# Altium schematic sheet sch.SchDoc
size A; SheetNumber: 1; SheetTotal: 1
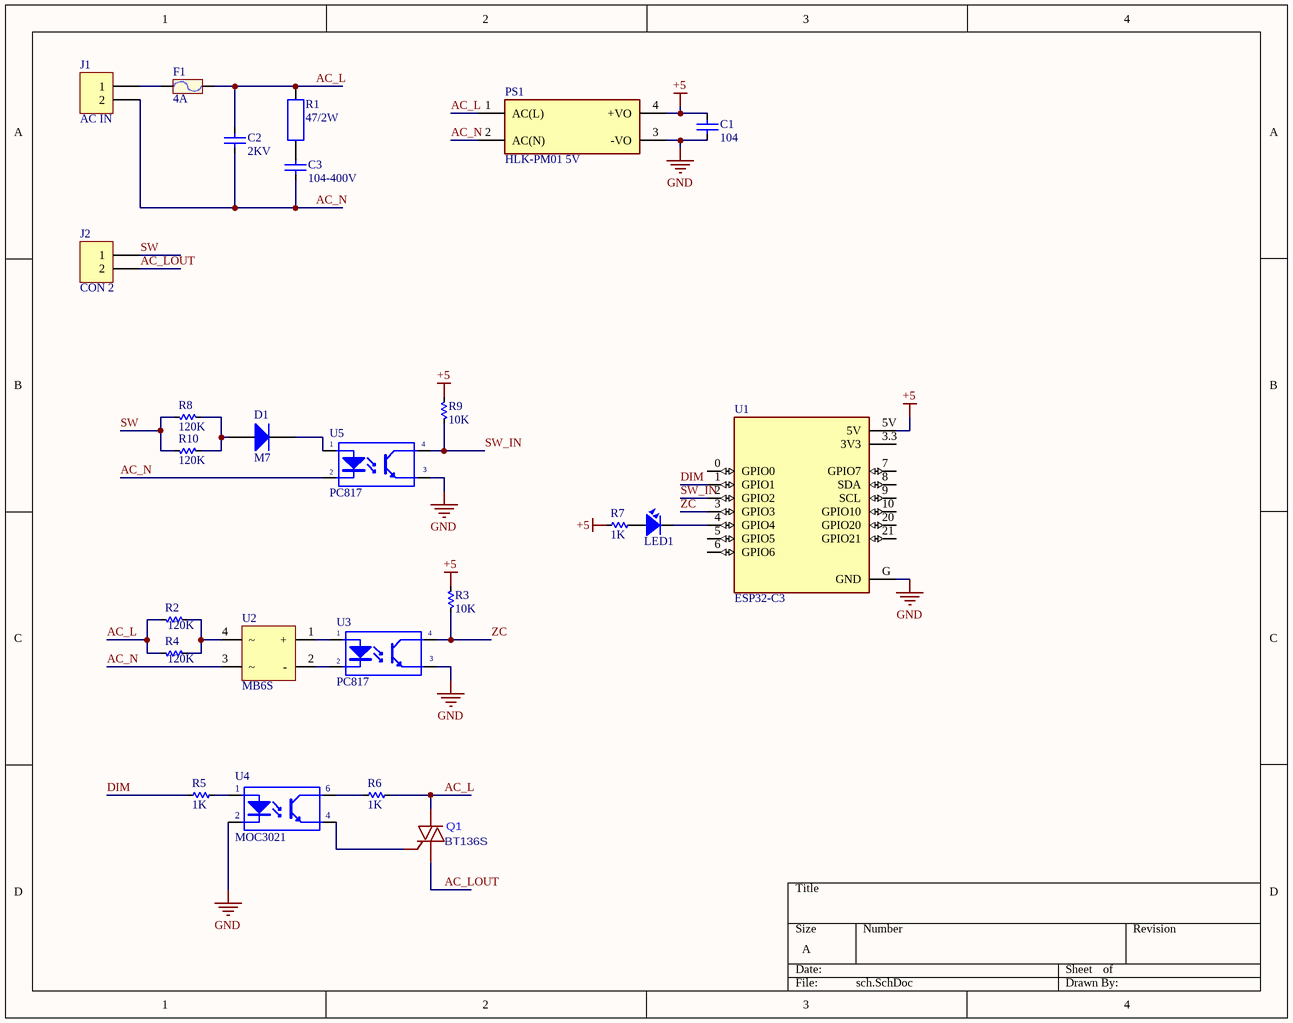
[diagram p0: sch.SchDoc]

## Parts
C1  104  [cap 0805]
C2  2KV  [Cap 7.5mm]
C3  104-400V  [Cap 10mm]
D1  M7  [DIODE SMA]
F1  4A  [Fuse rectangular]
J1  AC IN  [CON 2 2EDG5.08 B]
J2  CON 2  [CON 2 2EDG5.08 B]
LED1  LED  [LED-0805-Blue]  (value not drawn)
PS1  HLK-PM01 5V  [CONV_HLK-PM01-3W]
Q1  BT136S  [TO-252-3_L6.6-W6.1-P4.57-LS9.9-BR-CW]
R1  47/2W  [R2WD]
R2  120K  [RES-SMD-1210]
R3  10K  [RES-SMD-0805]
R4  120K  [RES-SMD-1210]
R5  1K  [RES-SMD-0805]
R6  1K  [RES-SMD-0805]
R7  1K  [RES-SMD-0805]
R8  120K  [RES-SMD-1210]
R9  10K  [RES-SMD-0805]
R10  120K  [RES-SMD-1210]
U1  ESP32-C3  [ESP32-C3-SMD]
U2  MB6S  [TO269AA]
U3  PC817  [SOP4]
U4  MOC3021  [SO6]
U5  PC817  [SOP4]

## Nets
+5: C1.1 PS1.4(+VO) R3.1 R7.2 R9.1 U1.5V
GND: C1.2 PS1.3(-VO) U1.G(GND) U3.3(E) U4.2(K) U5.3(E)
AC_L: C2.2 F1.2 PS1.1(AC(L)) Q1.2(T2) R1.2 R2.1 R4.1 R6.1
AC_LOUT: J2.2 Q1.1(T1)
AC_N: C2.1 C3.2 J1.2 PS1.2(AC(N)) U2.3 U5.2(K)
DIM: R5.2 U1.1(GPIO1)
SW: J2.1 R8.1 R10.1
SW_IN: R9.2 U1.2(GPIO2) U5.4(C)
ZC: R3.2 U1.3(GPIO3) U3.4(C)
NetC3_1: C3.1 R1.1
NetD1_1: D1.1(A) R8.2 R10.2
NetD1_2: D1.2(K) U5.1(A)
NetF1_1: F1.1 J1.1
NetLED1_1: LED1.1 R7.1
NetLED1_2: LED1.2 U1.4(GPIO4)
NetQ1_3: Q1.3(G) U4.4(E)
NetR2_2: R2.2 R4.2 U2.4
NetR5_1: R5.1 U4.1(A)
NetR6_2: R6.2 U4.6(C)
NetU2_1: U2.1(+) U3.1(A)
NetU2_2: U2.2(-) U3.2(K)

Not connected (* = marked no-connect by the designer): U1 0(GPIO0) 3.3(3V3) 5(GPIO5) 6(GPIO6) 7(GPIO7) 8(SDA) 9(SCL) 10(GPIO10) 20(GPIO20) 21(GPIO21)

## Library data of the parts
C1 C3 = CN: Capacitor
C2 = Cap 103 2KV: Capacitor Ceramic 2KV
D1 = Diode M7 ( 4007 ): Dán; Don_Vi: Con; Ten_Linh_Kien: Diode M7 1N4007 SMD 1A 1000V; Ma_Hang: MH000944; Chung_Loai: Dán; Ghi_Chu: *
F1 = Fuse: Designed by: VanDungEvn; Value: Fuse
J1 J2 = CON 2 EDG: CON2 KF terminal
LED1 = LED SMD: Value: LED 3 - 5 ly 2 Colour
PS1 = CONV HLK-PM01: 220VAC to 5V
Q1 = BT136-800E_C2901010
R1 = R2W: Resistor 2W; Value: R2W - 47
R2-R10 = Res-SMD: Resistor; Manufacturer: Generic Components; Class: Passive; Published: 08/06/2000; Publisher: Altium Hobart Technology Centre
U2 = MB6S: Bridge Rectifier
U3 U5 = OPTO PC817 SMD: Single Opto; Value: PC817
U4 = MOC3021: Single Opto; Value: MOC3021